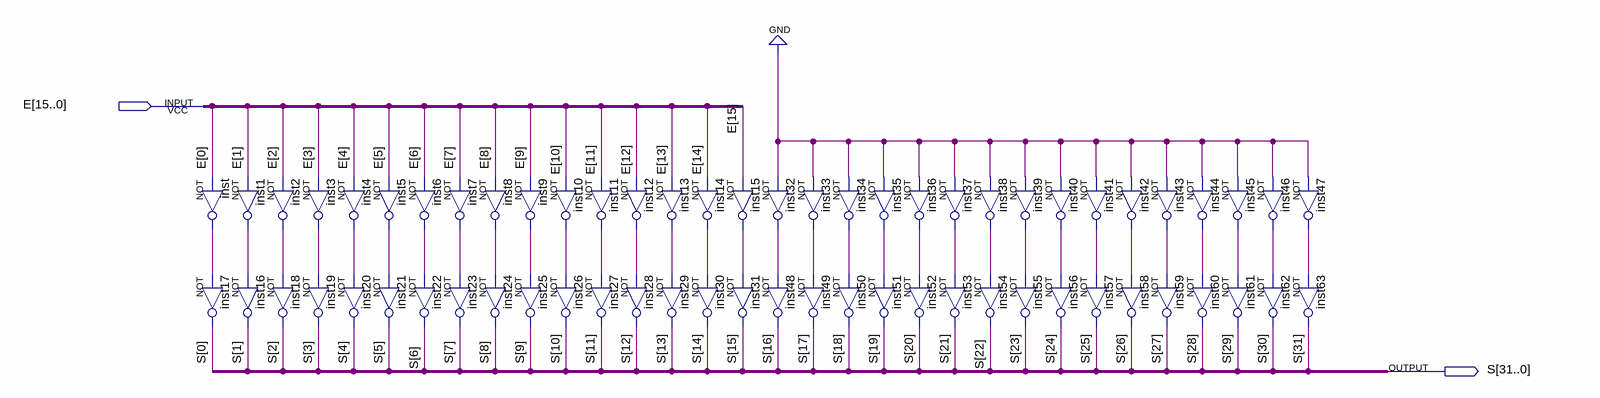
[diagram p0: schematic sheet]
// Quartus schematic Ext_Zero.bdf as structural Verilog: 64 symbols, 2 pins
module Ext_Zero (
  input  [15:0] E,
  output [31:0] S
);

  wire inst1_out, inst2_out, inst3_out, inst4_out, inst5_out, inst6_out, inst7_out, inst8_out, inst9_out,
       inst10_out, inst11_out, inst12_out, inst13_out, inst14_out, inst15_out, inst32_out, inst33_out,
       inst34_out, inst35_out, inst36_out, inst37_out, inst38_out, inst39_out, inst40_out, inst41_out,
       inst42_out, inst43_out, inst44_out, inst45_out, inst46_out, inst47_out, inst_out;

  not inst (inst_out, E[0]);
  not inst1 (inst1_out, E[1]);
  not inst17 (S[0], inst_out);
  not inst16 (S[1], inst1_out);
  not inst2 (inst2_out, E[2]);
  not inst3 (inst3_out, E[3]);
  not inst18 (S[2], inst2_out);
  not inst19 (S[3], inst3_out);
  not inst4 (inst4_out, E[4]);
  not inst5 (inst5_out, E[5]);
  not inst20 (S[4], inst4_out);
  not inst21 (S[5], inst5_out);
  not inst6 (inst6_out, E[6]);
  not inst7 (inst7_out, E[7]);
  not inst22 (S[6], inst6_out);
  not inst23 (S[7], inst7_out);
  not inst8 (inst8_out, E[8]);
  not inst9 (inst9_out, E[9]);
  not inst24 (S[8], inst8_out);
  not inst25 (S[9], inst9_out);
  not inst10 (inst10_out, E[10]);
  not inst11 (inst11_out, E[11]);
  not inst26 (S[10], inst10_out);
  not inst27 (S[11], inst11_out);
  not inst12 (inst12_out, E[12]);
  not inst13 (inst13_out, E[13]);
  not inst28 (S[12], inst12_out);
  not inst29 (S[13], inst13_out);
  not inst14 (inst14_out, E[14]);
  not inst15 (inst15_out, E[15]);
  not inst30 (S[14], inst14_out);
  not inst31 (S[15], inst15_out);
  not inst32 (inst32_out, 1'b0);
  not inst33 (inst33_out, 1'b0);
  not inst48 (S[16], inst32_out);
  not inst49 (S[17], inst33_out);
  not inst34 (inst34_out, 1'b0);
  not inst35 (inst35_out, 1'b0);
  not inst50 (S[18], inst34_out);
  not inst51 (S[19], inst35_out);
  not inst36 (inst36_out, 1'b0);
  not inst37 (inst37_out, 1'b0);
  not inst52 (S[20], inst36_out);
  not inst53 (S[21], inst37_out);
  not inst38 (inst38_out, 1'b0);
  not inst39 (inst39_out, 1'b0);
  not inst54 (S[22], inst38_out);
  not inst55 (S[23], inst39_out);
  not inst40 (inst40_out, 1'b0);
  not inst41 (inst41_out, 1'b0);
  not inst56 (S[24], inst40_out);
  not inst57 (S[25], inst41_out);
  not inst42 (inst42_out, 1'b0);
  not inst43 (inst43_out, 1'b0);
  not inst58 (S[26], inst42_out);
  not inst59 (S[27], inst43_out);
  not inst44 (inst44_out, 1'b0);
  not inst45 (inst45_out, 1'b0);
  not inst60 (S[28], inst44_out);
  not inst61 (S[29], inst45_out);
  not inst46 (inst46_out, 1'b0);
  not inst47 (inst47_out, 1'b0);
  not inst62 (S[30], inst46_out);
  not inst63 (S[31], inst47_out);
endmodule
